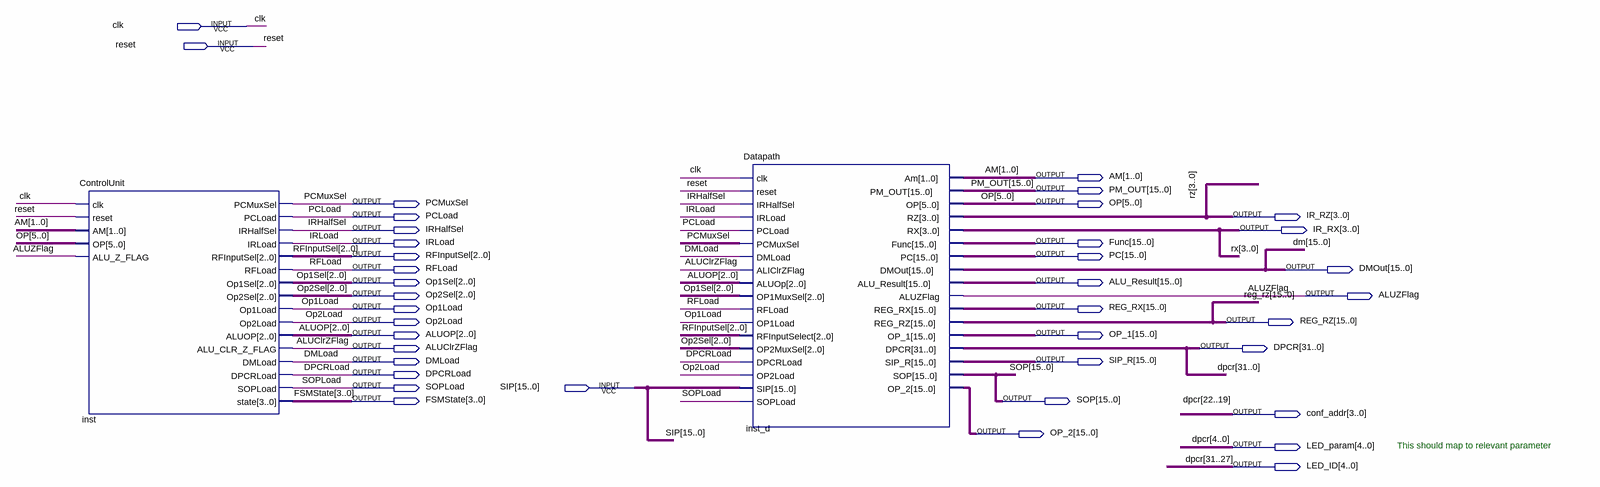
[diagram p0: schematic sheet]
// Quartus schematic RecopTopLevel.bdf as structural Verilog: 2 symbols, 39 pins
module RecopTopLevel (
  input  clk,
  input  reset,
  input  [15:0] SIP,
  output [1:0] AM,
  output [15:0] PM_OUT,
  output PCMuxSel,
  output [5:0] OP,
  output PCLoad,
  output [3:0] IR_RZ,
  output IRHalfSel,
  output [3:0] IR_RX,
  output IRLoad,
  output [15:0] Func,
  output [2:0] RFInputSel,
  output [15:0] PC,
  output RFLoad,
  output [15:0] DMOut,
  output [2:0] Op1Sel,
  output [15:0] ALU_Result,
  output [2:0] Op2Sel,
  output ALUZFlag,
  output Op1Load,
  output [15:0] REG_RX,
  output Op2Load,
  output [15:0] REG_RZ,
  output [2:0] ALUOP,
  output [15:0] OP_1,
  output ALUClrZFlag,
  output [31:0] DPCR,
  output DMLoad,
  output [15:0] SIP_R,
  output DPCRLoad,
  output SOPLoad,
  output [3:0] FSMState,
  output [15:0] SOP,
  output [3:0] conf_addr,
  output [15:0] OP_2,
  output [4:0] LED_param,
  output [4:0] LED_ID
);

  ControlUnit inst (
    .clk(clk), .reset(reset), .AM(AM), .OP(OP), .ALU_Z_FLAG(ALUZFlag), .PCMuxSel(PCMuxSel), .PCLoad(PCLoad),
    .IRHalfSel(IRHalfSel), .IRLoad(IRLoad), .RFInputSel(RFInputSel), .RFLoad(RFLoad), .Op1Sel(Op1Sel),
    .Op2Sel(Op2Sel), .Op1Load(Op1Load), .Op2Load(Op2Load), .ALUOP(ALUOP), .ALU_CLR_Z_FLAG(ALUClrZFlag),
    .DMLoad(DMLoad), .DPCRLoad(DPCRLoad), .SOPLoad(SOPLoad), .state(FSMState));
  Datapath inst_d (
    .clk(clk), .reset(reset), .IRHalfSel(IRHalfSel), .IRLoad(IRLoad), .PCLoad(PCLoad), .PCMuxSel(PCMuxSel),
    .DMLoad(DMLoad), .ALIClrZFlag(ALUClrZFlag), .ALUOp(ALUOP), .OP1MuxSel(Op1Sel), .RFLoad(RFLoad),
    .OP1Load(Op1Load), .RFInputSelect(RFInputSel), .OP2MuxSel(Op2Sel), .DPCRLoad(DPCRLoad),
    .OP2Load(Op2Load), .SIP(SIP), .SOPLoad(SOPLoad), .Am(AM), .PM_OUT(PM_OUT), .OP(OP), .RZ(IR_RZ),
    .RX(IR_RX), .Func(Func), .PC(PC), .DMOut(DMOut), .ALU_Result(ALU_Result), .ALUZFlag(ALUZFlag),
    .REG_RX(REG_RX), .REG_RZ(REG_RZ), .OP_1(OP_1), .DPCR({DPCR[31:23], conf_addr, DPCR[18:0]}),
    .SIP_R(SIP_R), .SOP(SOP), .OP_2(OP_2));

  assign DPCR[22:19] = conf_addr;
  assign LED_ID = DPCR[31:27];
  assign LED_param = DPCR[4:0];

  // Other names for the same wires on the sheet: dm[15:0] = DMOut; rz[3:0] = IR_RZ; rx[3:0] = IR_RX

  // Notes on the sheet:
  //   This should map to relevant parameter
endmodule
